# Altium schematic sheet power_supply.SchDoc
size A4; Organization: UNSW Solar Racing Team; Address3: UNSW; Address4: Sydney NSW 2052; Address2: Electrical Engineering; Address1: Rm 109
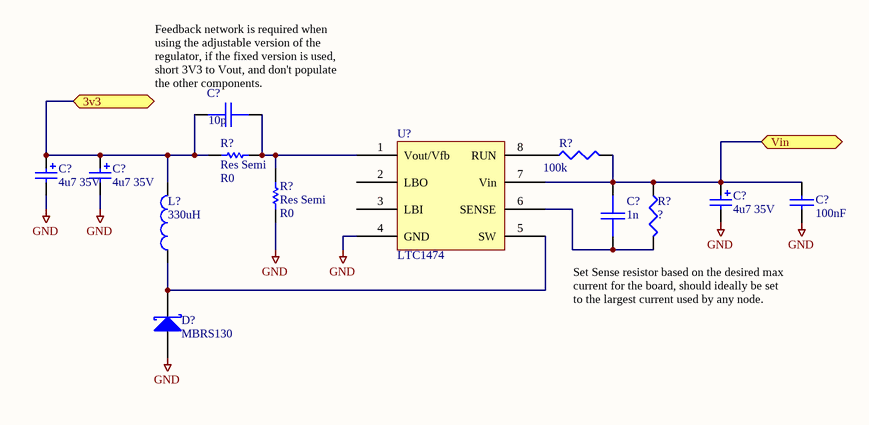
[diagram p0: power_supply.SchDoc]

## Parts
(Parts that share a designator on the sheet are numbered #1, #2 ... from top to bottom, then left to right.)
C?#1  10p  [0603]
C?#2  4u7 35V  [1812]
C?#3  4u7 35V  [1812]
C?#4  4u7 35V  [1812]
C?#5  100nF  [0603]
C?#6  1n  [0603]
D?  MBRS130  [SMB]
L?  330uH  [1812]
R?#1  Res Semi  value R0  [0603]
R?#2  100k  [0603]
R?#3  ?  [0603]
R?#4  Res Semi  value R0  [0603]
U?  LTC1474  [SO8]

## Ports
3v3, Vin

## Nets
GND: C?#2.2 C?#3.2 C?#4.2 C?#5.2 D?.A R?#4.1 U?.4(GND)
3v3: C?#1.1 C?#2.1 C?#3.1 L?.2 R?#1.1 ; port 3v3
Vin: C?#4.1 C?#5.1 C?#6.1 R?#2.2 R?#3.1 U?.7(Vin) ; port Vin
NetC?#1_2: C?#1.2 R?#1.2 R?#4.2 U?.1(Vout/Vfb)
NetC?#6_2: C?#6.2 R?#3.2 U?.6(SENSE)
NetD?_K: D?.K L?.1 U?.5(SW)
NetR?#2_1: R?#2.1 U?.8(RUN)

Not connected (* = marked no-connect by the designer): U? 2(LBO) 3(LBI)

## Notes on the sheet
- (near C?#1) Feedback network is required when using the adjustable version of the regulator, if the fixed version is used, short 3V3 to Vout, and don't populate the other components.
- Set Sense resistor based on the desired max current for the board, should ideally be set to the largest current used by any node.
- Title
- Size:
- Date:
- A4
- Number:
- Time:
- Revision:
- Sheet
- of
- File:

## Library data of the parts
C?#1 C?#6 = CAP: Capacitor; Value: 1nF; Revision: July-2002: Re-released for DXP Platform.; Farnell: 317-202; Price: 0.15
C?#2-C?#4 = Cap Pol3: Polarized Capacitor (Surface Mount); Value: 4.7uF; Revision: July-2002: Re-released for DXP Platform.; Farnell: 967-294; Price: 1.97
C?#5 = CAP: Capacitor; Needed?: NO - HW LAB; Value: 100nF
D? = D SCHOTTKY: Schottky Diode; Revision: July-2002: Re-released for DXP Platform.; Farnell: 708-150; Price: 1.49
L? = Inductor: Revision: July-2002: Re-released for DXP Platform.; Value: 330uH; Farnell: 200-451; Price: 2.90
R?#1 R?#4 = Res Semi: Semiconductor Resistor; Published: 8-Jun-2000; LatestRevisionDate: 17-Jul-2002; LatestRevisionNote: Re-released for DXP Platform.; PackageReference: AXIAL-0.5; Publisher: Altium Limited; PackageDescription: Axial Device, Thru-Hole; 2 Leads; 0.5 in Pin Spacing
R?#2 = RES1: Resistor; Value: 100k; Farnell: 612-728; Price: 0.13
R?#3 = RES1: Resistor; Value: 1.2R; Revision: July-2002: Re-released for DXP Platform.; Farnell: 360-2229; Price: 0.15
U? = LTC1474: Step-down converter; Farnell: NA